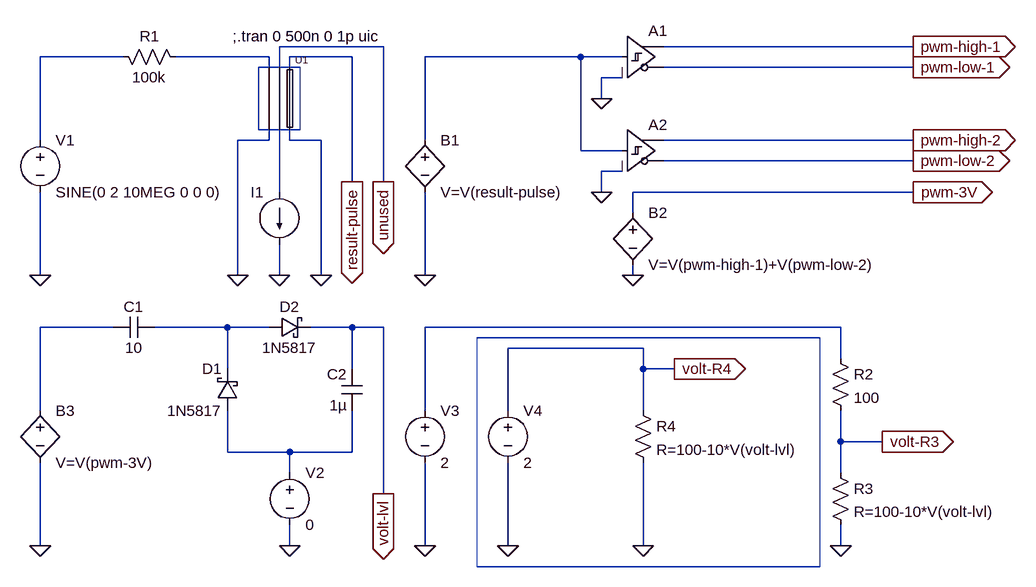
[diagram p0: schematic circuit.asc]
circuit.asc, the LTspice schematic file:
Version 4
SHEET 1 1648 1268
WIRE 256 80 96 80
WIRE 1072 80 688 80
WIRE -144 96 -272 96
WIRE 80 96 -64 96
WIRE 208 96 112 96
WIRE 560 96 320 96
WIRE 624 96 560 96
WIRE 80 112 80 96
WIRE 96 112 96 80
WIRE 112 112 112 96
WIRE 1072 112 688 112
WIRE 624 128 592 128
WIRE 592 160 592 128
WIRE -272 224 -272 96
WIRE 80 224 80 208
WIRE 80 224 32 224
WIRE 112 224 112 208
WIRE 160 224 112 224
WIRE 320 224 320 96
WIRE 1072 224 688 224
WIRE 560 240 560 96
WIRE 624 240 560 240
WIRE 1072 256 688 256
WIRE 624 272 592 272
WIRE 208 288 208 96
WIRE 256 288 256 80
WIRE 96 304 96 208
WIRE 592 304 592 272
WIRE 1072 304 640 304
WIRE 640 336 640 304
WIRE -272 432 -272 304
WIRE 32 432 32 224
WIRE 96 432 96 384
WIRE 160 432 160 224
WIRE 320 432 320 304
WIRE 640 432 640 416
WIRE -160 512 -272 512
WIRE 16 512 -96 512
WIRE 80 512 16 512
WIRE 208 512 144 512
WIRE 256 512 208 512
WIRE 960 512 320 512
WIRE 656 544 448 544
WIRE 960 560 960 512
WIRE 16 576 16 512
WIRE 208 576 208 512
WIRE 656 576 656 544
WIRE 704 576 656 576
WIRE -272 640 -272 512
WIRE 320 640 320 512
WIRE 448 640 448 544
WIRE 656 640 656 576
WIRE 960 688 960 640
WIRE 1024 688 960 688
WIRE 16 704 16 640
WIRE 112 704 16 704
WIRE 208 704 208 640
WIRE 208 704 112 704
WIRE 112 736 112 704
WIRE 960 736 960 688
WIRE 256 768 256 512
WIRE -272 848 -272 720
WIRE 112 848 112 816
WIRE 320 848 320 720
WIRE 448 848 448 720
WIRE 656 848 656 720
WIRE 960 848 960 816
FLAG 96 432 0
FLAG 32 432 0
FLAG 160 432 0
FLAG 208 288 result-pulse
IOPIN 208 288 Out
FLAG 256 288 unused
IOPIN 256 288 Out
FLAG -272 432 0
FLAG 320 432 0
FLAG 592 160 0
FLAG 1072 80 pwm-high-1
IOPIN 1072 80 Out
FLAG 1072 112 pwm-low-1
IOPIN 1072 112 Out
FLAG 1072 224 pwm-high-2
IOPIN 1072 224 Out
FLAG 1072 256 pwm-low-2
IOPIN 1072 256 Out
FLAG 640 432 0
FLAG 1072 304 pwm-3V
IOPIN 1072 304 Out
FLAG 112 848 0
FLAG -272 848 0
FLAG 592 304 0
FLAG 256 768 volt-lvl
IOPIN 256 768 Out
FLAG 320 848 0
FLAG 960 848 0
FLAG 448 848 0
FLAG 656 848 0
FLAG 704 576 volt-R4
IOPIN 704 576 Out
FLAG 1024 688 volt-R3
IOPIN 1024 688 Out
SYMBOL current 96 304 M0
WINDOW 3 24 28 Invisible 2
WINDOW 123 0 0 Left 0
WINDOW 39 24 28 Left 2
SYMATTR Value PWL file=C:\Users\zewen\Downloads\nanowirepp\pwl\gaussian.txt
SYMATTR InstName I1
SYMBOL voltage -272 208 R0
SYMATTR InstName V1
SYMATTR Value SINE(0 2 10MEG 0 0 0)
SYMBOL res -160 80 M90
WINDOW 0 0 56 VBottom 2
WINDOW 3 32 56 VTop 2
SYMATTR InstName R1
SYMATTR Value 100k
SYMBOL nanowire 96 160 R0
SYMATTR InstName U1
SYMBOL bv 320 208 R0
SYMATTR InstName B1
SYMATTR Value V=V(result-pulse)
SYMBOL Digital\\schmitt 624 32 R0
WINDOW 3 0 112 Invisible 2
SYMATTR Value vt=1m vh=0 vhigh=3 vlow=0
SYMATTR InstName A1
SYMBOL Digital\\schmitt 624 176 R0
WINDOW 3 0 0 Invisible 0
SYMATTR Value vt=-1m vh=0 vhigh=3 vlow=0
SYMATTR InstName A2
SYMBOL bv 640 320 R0
SYMATTR InstName B2
SYMATTR Value V=V(pwm-high-1)+V(pwm-low-2)
SYMBOL bv -272 624 R0
SYMATTR InstName B3
SYMATTR Value V=V(pwm-3V)
SYMBOL voltage 112 720 R0
SYMATTR InstName V2
SYMATTR Value 0
SYMBOL cap 224 576 M0
SYMATTR InstName C2
SYMATTR Value 1µ
SYMBOL cap -96 496 R90
WINDOW 0 0 32 VBottom 2
WINDOW 3 32 32 VTop 2
SYMATTR InstName C1
SYMATTR Value 10
SYMBOL schottky 32 640 R180
WINDOW 0 24 64 Left 2
WINDOW 3 24 0 Left 2
SYMATTR InstName D1
SYMATTR Value 1N5817
SYMATTR Description Diode
SYMATTR Type diode
SYMBOL schottky 80 528 R270
WINDOW 0 32 32 VTop 2
WINDOW 3 0 32 VBottom 2
SYMATTR InstName D2
SYMATTR Value 1N5817
SYMATTR Description Diode
SYMATTR Type diode
SYMBOL voltage 320 624 R0
WINDOW 123 0 0 Left 0
WINDOW 39 0 0 Left 0
SYMATTR InstName V3
SYMATTR Value 2
SYMBOL res 944 720 R0
SYMATTR InstName R3
SYMATTR Value R=100-10*V(volt-lvl)
SYMBOL res 944 544 R0
SYMATTR InstName R2
SYMATTR Value 100
SYMBOL voltage 448 624 R0
SYMATTR InstName V4
SYMATTR Value 2
SYMBOL res 640 624 R0
SYMATTR InstName R4
SYMATTR Value R=100-10*V(volt-lvl)
TEXT 24 64 Left 2 !;.tran 0 500n 0 1p uic
RECTANGLE Normal 128 208 64 112
RECTANGLE Normal 928 880 400 528

The netlist it stands for:
* circuit.asc
I1 N004 0 PWL file=C:\Users\zewen\Downloads\nanowirepp\pwl\gaussian.txt
V1 N001 0 SINE(0 2 10MEG 0 0 0)
R1 N001 N002 100k
XU1 N002 0 unused N004 result-pulse 0 nanowire  ; pins g1 g2 n1 n2 n3 n4
B1 N003 0 V=V(result-pulse)
A1 N003 0 0 0 0 pwm-low-1 pwm-high-1 0 SCHMITT vt=1m vh=0 vhigh=3 vlow=0
A2 N003 0 0 0 0 pwm-low-2 pwm-high-2 0 SCHMITT vt=-1m vh=0 vhigh=3 vlow=0
B2 pwm-3V 0 V=V(pwm-high-1)+V(pwm-low-2)
B3 N005 0 V=V(pwm-3V)
V2 N008 0 0
C2 volt-lvl N008 1µ
C1 N006 N005 10
D1 N008 N006 1N5817
D2 N006 volt-lvl 1N5817
V3 N007 0 2
R3 volt-R3 0 R=100-10*V(volt-lvl)
R2 N007 volt-R3 100
V4 volt-R4 0 2
R4 volt-R4 0 R=100-10*V(volt-lvl)
.model D D
.lib standard.dio
;.tran 0 500n 0 1p uic
.lib nanowire.lib
.backanno
.end